# EAGLE schematic nanopi-duo2-shield (EAGLE 9.3.1)
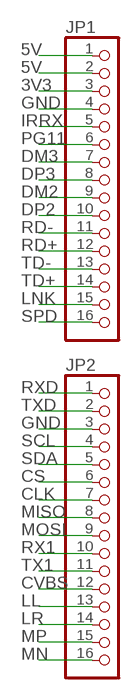
[diagram p0: schematic, sheet 1]

## Parts
JP1  PINHD-1X16/OCT  [1X16/OCT]
JP2  PINHD-1X16/OCT  [1X16/OCT]

## Nets
3V3: JP1.3
5V: JP1.1 JP1.2
CLK: JP2.7
CS: JP2.6
CVBS: JP2.12
DM2: JP1.9
DM3: JP1.7
DP2: JP1.10
DP3: JP1.8
GND: JP1.4 JP2.3
IRRX: JP1.5
LL: JP2.13
LNK: JP1.15
LR: JP2.14
MISO: JP2.8
MN: JP2.16
MOSI: JP2.9
MP: JP2.15
PG11: JP1.6
RD+: JP1.12
RD-: JP1.11
RX1: JP2.10
RXD: JP2.1
SCL: JP2.4
SDA: JP2.5
SPD: JP1.16
TD+: JP1.14
TD-: JP1.13
TX1: JP2.11
TXD: JP2.2

## Library data of the parts
JP1 JP2 = pinhead_v2:PINHD-1X16: PIN HEADER